# EAGLE design LightLog_SMD_0.6C (EAGLE 7.2.0)
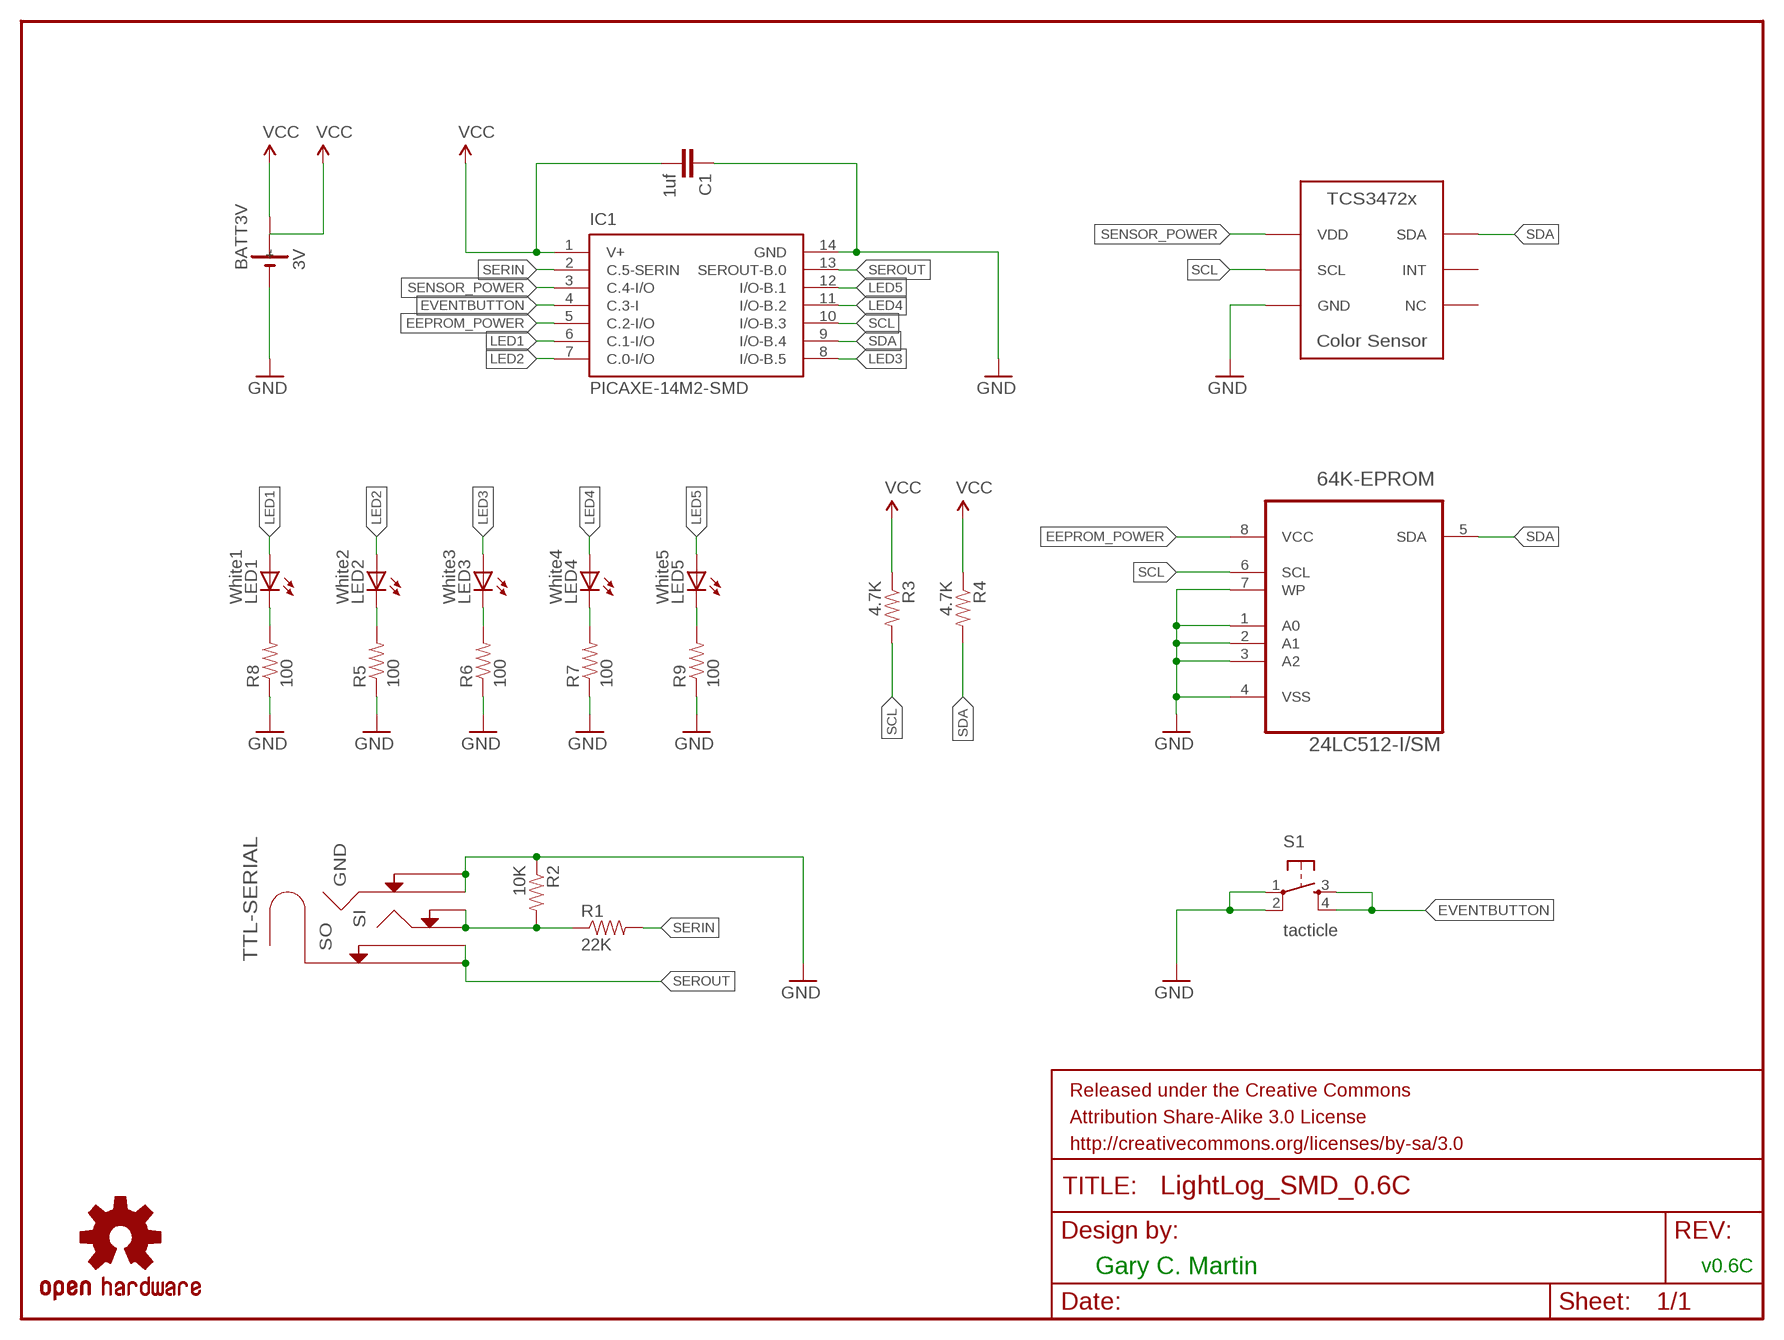
[diagram p0: schematic, sheet 1]

## Parts
64K-EPROM  24LC512-I/SM  [SOIC127P794X203-8N]
BATT3V  3V  BAT-HLD-001-CR2032  [BAT-HLD-001-CR2032-SMD]
C1  1uf  CAP0805  [0805]
IC1  PICAXE-14M2-SMD  [SOIC14]
LED1  White1  LED1206  [LED-1206]
LED2  White2  LED1206  [LED-1206]
LED3  White3  LED1206  [LED-1206]
LED4  White4  LED1206  [LED-1206]
LED5  White5  LED1206  [LED-1206]
LOGO1  OSHW-LOGOS  [OSHW-LOGO-S]
R1  22K  RESISTOR0805-RES  [0805]
R2  10K  RESISTOR0805-RES  [0805]
R3  4.7K  RESISTOR0805-RES  [0805]
R4  4.7K  RESISTOR0805-RES  [0805]
R5  100  RESISTOR0805-RES  [0805]
R6  100  RESISTOR0805-RES  [0805]
R7  100  RESISTOR0805-RES  [0805]
R8  100  RESISTOR0805-RES  [0805]
R9  100  RESISTOR0805-RES  [0805]
S1  tacticle  TAC_SWITCHSMD  [TACTILE_SWITCH_SMD]
TTL-SERIAL  3-5MM-STEREO-SOCKET  [3-5MM-SMT]
U$1  TCS3472  [DUAL-FLAT-NO-LEAD-6PIN]

## Nets
EEPROM_POWER: 64K-EPROM.8(VCC) IC1.5(C.2-I/O)
EVENTBUTTON: IC1.4(C.3-I) S1.3 S1.4
GND: 64K-EPROM.1(A0) 64K-EPROM.2(A1) 64K-EPROM.3(A2) 64K-EPROM.4(VSS) 64K-EPROM.7(WP) BATT3V.NEG(-) C1.1 IC1.14(GND) R2.1 R5.1 R6.1 R7.1 R8.1 R9.1 S1.1 S1.2 TTL-SERIAL.5 TTL-SERIAL.6 U$1.3(GND)
LED1: IC1.6(C.1-I/O) LED1.A
LED2: IC1.7(C.0-I/O) LED2.A
LED3: IC1.8(I/O-B.5) LED3.A
LED4: IC1.11(I/O-B.2) LED4.A
LED5: IC1.12(I/O-B.1) LED5.A
N$1: LED2.C R5.2
N$2: R1.1 R2.2 TTL-SERIAL.3 TTL-SERIAL.4
N$3: LED3.C R6.2
N$4: LED4.C R7.2
N$5: LED5.C R9.2
N$11: LED1.C R8.2
SCL: 64K-EPROM.6(SCL) IC1.10(I/O-B.3) R3.2 U$1.2(SCL)
SDA: 64K-EPROM.5(SDA) IC1.9(I/O-B.4) R4.2 U$1.6(SDA)
SENSOR_POWER: IC1.3(C.4-I/O) U$1.1(VDD)
SERIN: IC1.2(C.5-SERIN) R1.2
SEROUT: IC1.13(SEROUT-B.0) TTL-SERIAL.1 TTL-SERIAL.2
VCC: BATT3V.POS1(+) BATT3V.POS2(+) C1.2 IC1.1(V+) R3.1 R4.1
Unconnected: U$1.4(NC) U$1.5(INT)

## Notes on the sheet
- Gary C. Martin | v0.6C

## Library data of the parts
64K-EPROM = gary:24LC512-I/SM: 512K I2C Serial EEPROM; MPN: 24LC512-I/SM; OC_FARNELL: 9758038; OC_NEWARK: 62K0582; PACKAGE: SOIC-8; SUPPLIER: MICROCHIP
BATT3V = LightLog_SMD_0.6:BAT-HLD-001-CR2032: CR2032 Holder CR2032 surface mount battery holder
C1 = SparkFun-Capacitors:CAP: Capacitor Standard 0603 ceramic capacitor, and 0.1" leaded capacitor.
IC1 = LightLog_SMD_0.6:PICAXE-14M2
LED1-LED5 = SparkFun-LED:LED: LEDs Standard schematic elements and footprints for 5mm, 3mm, 1206, and 0603 sized LEDs. 5mm - Spark Fun Electronics SKU : COM-00529 (and others)
LOGO1 = SparkFun-Aesthetics:OSHW-LOGO: Open Source Hardware Logo This logo indicates the piece of hardware it is found on incorporates a OSHW license and/or adheres to the definition of open source hardware found here: http://freedomdefined.org/OSHW
R1-R9 = SparkFun-Resistors:RESISTOR: Resistor Basic schematic elements and footprints for 0603, 1206, and PTH resistors.
S1 = gary:TAC_SWITCH: Momentary Switch Button commonly used for reset or general input.
TTL-SERIAL = gary:3-5MM-STEREO-SOCKET: 3.5mm Stereo Socket Surface mount, three pole connector
U$1 = gary:TCS3472: TCS3472x device

## Board
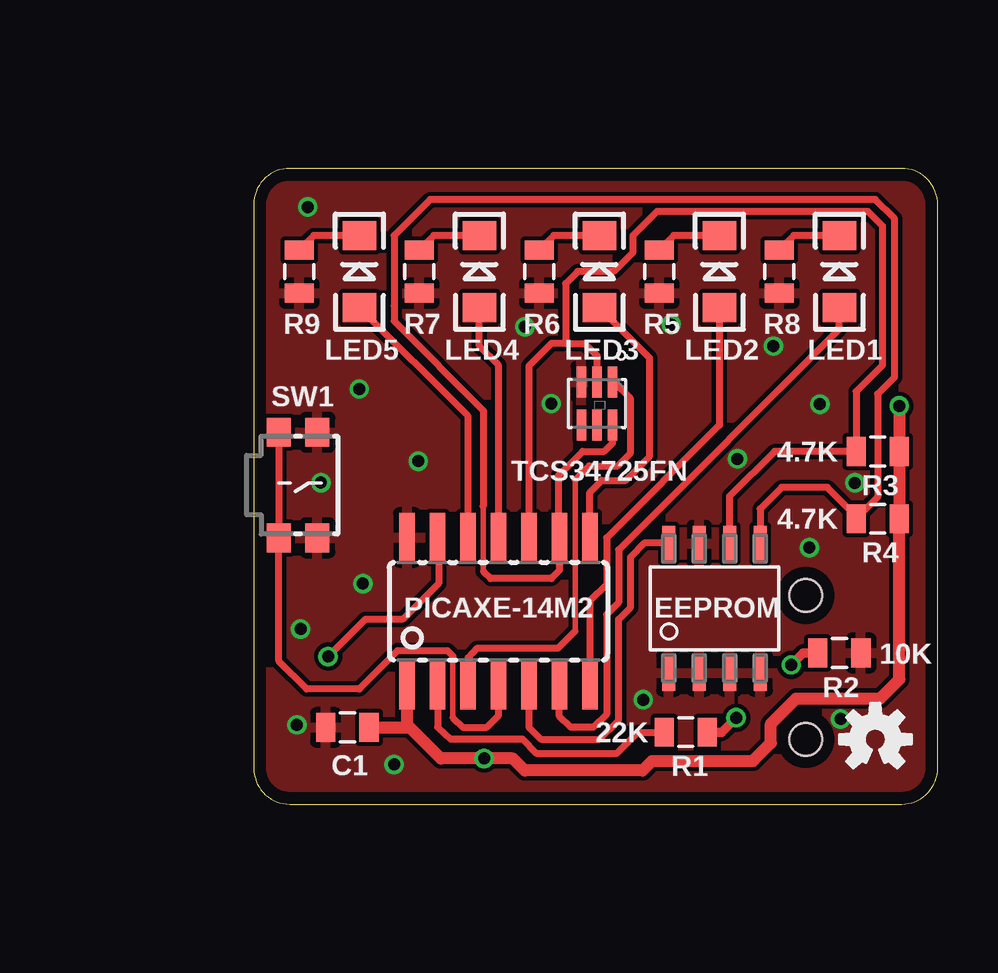
[diagram p1: board, top side]
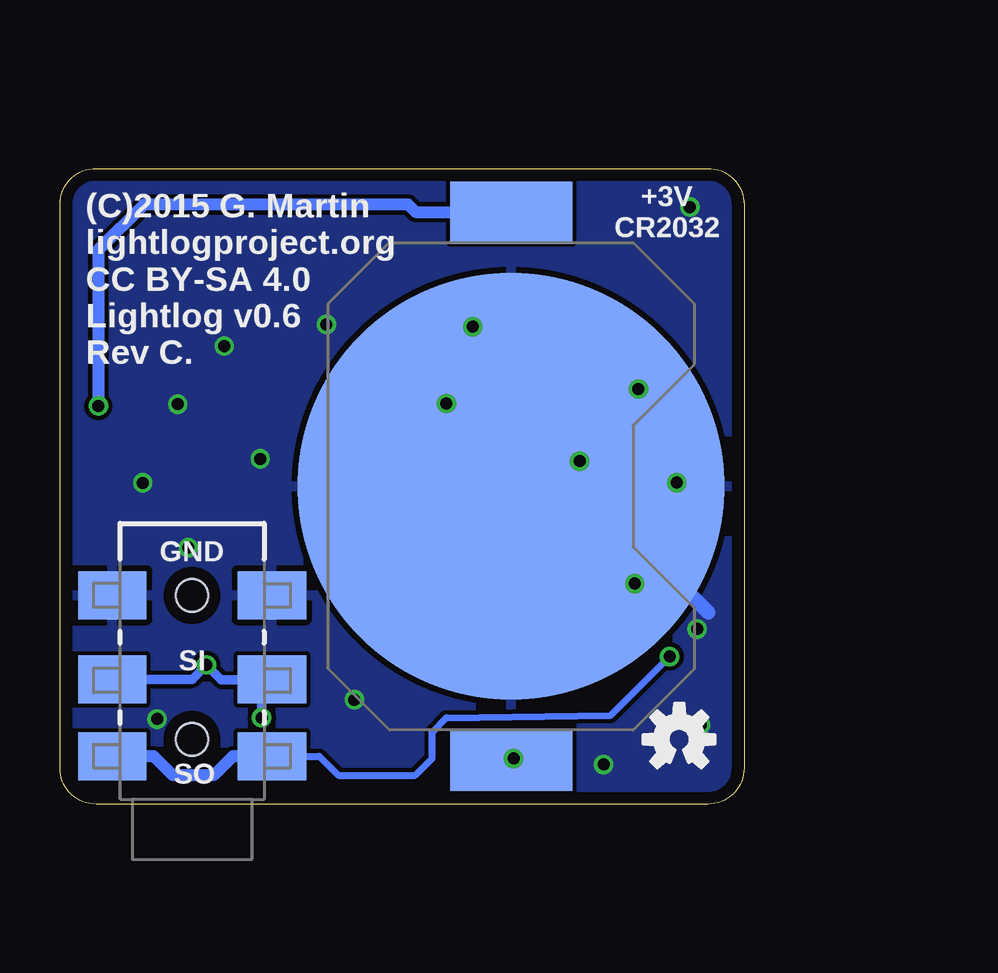
[diagram p2: board, bottom side, seen from below]

Size 28.5 x 26.5 mm. Coordinates in mm from the lower left corner, seen from the top.
Outline: 1.5,0 27,0 arc90 28.5,1.5 28.5,25 arc90 27,26.5 1.5,26.5 arc90 0,25 0,1.5 arc90 1.5,0
Copper layers (1*16): Top 0.035mm / dielectric 1.5mm / Bottom 0.035mm
Design rules "Smart-Prototyping-com-EagleRules *": minimum track width 7mil, minimum drill 12mil, track to track 7mil, track to pad 7mil, pad to pad 7mil, via to via 7mil, smd to smd 0mil, copper to edge 20mil, drill to drill 10mil, minimum pad ring 10mil, minimum via ring 6mil, stop-mask expansion 2mil, vias tented up to drill 25mil, thermal gap 10mil

### Footprints (pad centres in the part's own frame; a part is rotated, then mirrored left to right if it is on the bottom)
SOIC127P794X203-8N = smd 1.473 x 0.559: 1 -2.739,1.905; 2 -2.739,0.635; 3 -2.739,-0.635; 4 -2.739,-1.905; 5 2.659,-1.905; 6 2.659,-0.635; 7 2.659,0.635; 8 2.659,1.905
BAT-HLD-001-CR2032-SMD = smd 17.78 x 17.78: NEG 0,0 | smd 2.54 x 5.08: POS1 -11.43,0; POS2 11.43,0
0805 = smd 0.8 x 1.2: 1 -0.9,0; 2 0.9,0
SOIC14 = smd 2.032 x 0.66: 1 -3.232,3.81; 2 -3.232,2.54; 3 -3.232,1.27; 4 -3.232,0; 5 -3.232,-1.27; 6 -3.232,-2.54; 7 -3.232,-3.81; 8 2.915,-3.81; 9 2.915,-2.54; 10 2.915,-1.27; 11 2.915,0; 12 2.915,1.27; 13 2.915,2.54; 14 2.915,3.81
LED-1206 = smd 1.2 x 1.4: A -1.5,0; C 1.5,0
TACTILE_SWITCH_SMD = smd 1.2 x 1: 1 -2.2,0.805; 2 2.2,0.805; 3 -2.2,-0.805; 4 2.2,-0.805
3-5MM-SMT = smd 2 x 2.85: 1 -3.2,3.325; 2 -3.2,-3.325; 3 0,3.325; 4 0,-3.325; 5 3.5,3.325; 6 3.5,-3.325 | hole 1.35: 3.5,0; -2.5,0
DUAL-FLAT-NO-LEAD-6PIN = smd 1.3 x 0.4: 1 -0.9,0.65; 2 -0.9,0; 3 -0.9,-0.65; 4 0.9,-0.65; 5 0.9,0; 6 0.9,0.65

### Placement (x,y rotation side)
64K-EPROM  19.2,8.2 90 top
BATT3V  9.7,13.25 90 bottom
C1  3.9,3.2 0 top
IC1  10.2,8.2 90 top
LED1  24.4,22.2 90 top
LED2  19.4,22.2 90 top
LED3  14.4,22.2 90 top
LED4  9.4,22.2 90 top
LED5  4.4,22.2 90 top
LOGO1  25.9,2.7 0 top
LOGO2  OSHW-LOGOS  [OSHW-LOGO-S]  2.7,2.7 0 bottom
R1  18,3 180 top
R2  24.4,6.3 180 top
R3  26,14.7 180 top
R4  26,11.9 180 top
R5  16.9,22.2 90 top
R6  11.9,22.2 90 top
R7  6.9,22.2 90 top
R8  21.9,22.2 90 top
R9  1.9,22.2 90 top
S1  1.85,13.3 270 top
TTL-SERIAL  23,5.2 90 bottom
U$1  14.3,16.7 270 top

### Tracks (layer width: path | path; a pad name or v marks a point on that pad's centre or on a via)
EEPROM_POWER
  Top 0.3: IC1.5 11.47,3.2 11.97,2.7 14.4,2.7 15.2,3.5 15.2,7.7 15.7,8.2 15.7,10.3 16.3,10.9 17.25,10.9 64K-EPROM.8
EVENTBUTTON
  Top 0.23: 8.3,3.6 8.3,6.18
  Top 0.3: S1.3 S1.4 | 1.04,11.36 S1.4 | 8.3,3.6 8.7,3.2 9.7,3.2 10.2,3.7 IC1.4 | 8.3,6.18 8.07,6.4 6,6.4 4.4,4.8 2.2,4.8 1.04,5.96 S1.4
GND  (via drill 0.5)
  Bottom 0.4: v12.4,16.7 12.4,15.95 BATT3V.NEG 11.3,14.85 v11.3,19.9
  Bottom 0.6: 3,9.5 1.5,8
  other vias: 23.59,16.67 2.25,24.89 1.8,3.3 23.15,10.69 24.45,3.54 16.23,4.35 21.65,19.09 4.55,9.19 2.8,13.4 17.4,20 20.15,14.39 1.95,7.29 6.85,14.29 4.4,17.3 25.05,13.39 5.85,1.65
  pour Top: -0.8,27.2 29.2,27.2 29.2,-0.3 -0.8,-0.3
  pour Bottom: -1.3,27.7 29.7,27.7 29.7,-0.8 -1.3,-0.8
LED1
  Top 0.3: IC1.6 12.74,3.65 13.2,3.2 14.15,3.2 14.7,3.75 14.7,7.9 15.2,8.4 15.2,10.6 24.4,19.8 LED1.A
LED2
  Top 0.3: LED2.A 19.4,15.8 14.7,11.1 14.7,9.16 14.01,8.47 IC1.7
LED3
  Top 0.3: IC1.8 14.01,13 14.5,13.5 15.5,13.5 16.5,14.5 16.5,18.6 LED3.A
LED4
  Top 0.3: IC1.11 10.2,18.3 9.4,19.1 LED4.A
LED5
  Top 0.3: IC1.12 8.93,16.17 LED5.A
N$1
  Top 0.3: LED2.C 17.5,23.7 R5.2
N$2  (via drill 0.5)
  Top 0.4: R1.1 19.5,3 v20.1,3.6 | R2.2 22.9,6.3 v22.4,5.8
  Bottom 0.4: v20.1,3.6 20.1,5.17 | 20.1,5.17 TTL-SERIAL.4 | 20.1,5.17 21.77,5.17 v22.4,5.8 23,5.2 TTL-SERIAL.3
N$3
  Top 0.3: LED3.C 12.5,23.7 R6.2
N$4
  Top 0.3: LED4.C 7.5,23.7 R7.2
N$5
  Top 0.3: LED5.C 2.5,23.7 R9.2
N$11
  Top 0.3: LED1.C 22.5,23.7 R8.2
SCL
  Top 0.3: 13,19.2 12.4,19.2 11.47,18.27 IC1.10 | 64K-EPROM.6 19.84,12.84 21.7,14.7 R3.2 25.1,17.2 26.2,18.3 26.2,24.1 25.6,24.7 16.8,24.7 15.8,23.7 15.8,23 15,22.2 13.5,22.2 13,21.7 13,19.2 | 13,19.2 13.8,19.2 14.3,18.7 U$1.2
SDA
  Top 0.2: IC1.9 12.7,10.15
  Top 0.23: 9.56,12.41 9.57,9.7
  Top 0.3: 12.7,10.15 12.7,13.7 13.7,14.7 14.6,14.7 14.95,15.05 U$1.6 | 9.56,12.41 9.57,16.4 5.85,20.14 5.85,20.76 5.85,23.7 7.35,25.2 25.9,25.2 26.7,24.4 26.7,17.8 26,17.1 26,12.8 R4.2 25.1,12 23.9,13.2 22,13.2 21.11,12.3 64K-EPROM.5 | 9.57,9.7 9.87,9.4 12.4,9.4 12.74,9.74 IC1.9
SENSOR_POWER
  Top 0.2: 15,17.6 U$1.1
  Top 0.23: 13.39,13.52 13.39,7.21
  Top 0.3: 13.39,7.21 12.68,6.5 9.3,6.5 8.93,6.1 IC1.3 | 13.39,13.52 13.97,14.1 15.16,14.1 15.7,14.64 15.7,16.9 15,17.6
SERIN
  Top 0.3: IC1.2 7.66,3.2 8.2,2.7 11.2,2.7 11.8,2.1 15.1,2.1 16,3 R1.2
SEROUT  (via drill 0.5)
  Top 0.3: 7.7,10.07 IC1.13 | IC1.13 7.66,10.16 | v3.1,6.15 4.65,7.7 6.2,7.7 7.7,9.2 7.7,11.12 IC1.13
  Bottom 0.3: TTL-SERIAL.2 17.7,2 16.9,1.2 13.7,1.2 13,1.9 13,3 12.4,3.6 5.55,3.7 v3.1,6.15
  Bottom 0.5: TTL-SERIAL.2 21.3,2 22.1,1.2 23.8,1.2 24.6,2 TTL-SERIAL.1
VCC  (via drill 0.5)
  Top 0.4: 6.39,3.2 6.39,3.31 | v26.9,16.6 26.9,16.4
  Top 0.5: IC1.1 6.39,3.31 7.8,1.9 v9.6,1.9 10.8,1.9 11.3,1.4 16.2,1.4 16.6,1.8 20.8,1.8 21.55,2.55 21.55,3.35 22.6,4.4 26.1,4.4 26.9,5.2 R4.1 R3.1 26.9,16.4 | C1.2 6.39,3.2
  Bottom 0.3: v9.6,1.9 BATT3V.POS1
  Bottom 0.5: v26.9,16.6 26.9,23.1 25,25 14,25 13.68,24.68 BATT3V.POS2

### Text on the board
tPlace: R9 | R7 | R6 | R5 | R8 | LED5 | LED4 | LED3 | LED2 | LED1 | SW1 | 4.7K | TCS34725FN | R3 | 4.7K | R4 | PICAXE-14M2 | EEPROM | C1
bPlace: +3V / CR2032 | (C)2015 G. Martin / lightlogproject.org / CC BY-SA 4.0 / Lightlog v0.6 / Rev C. | GND | SI | SO